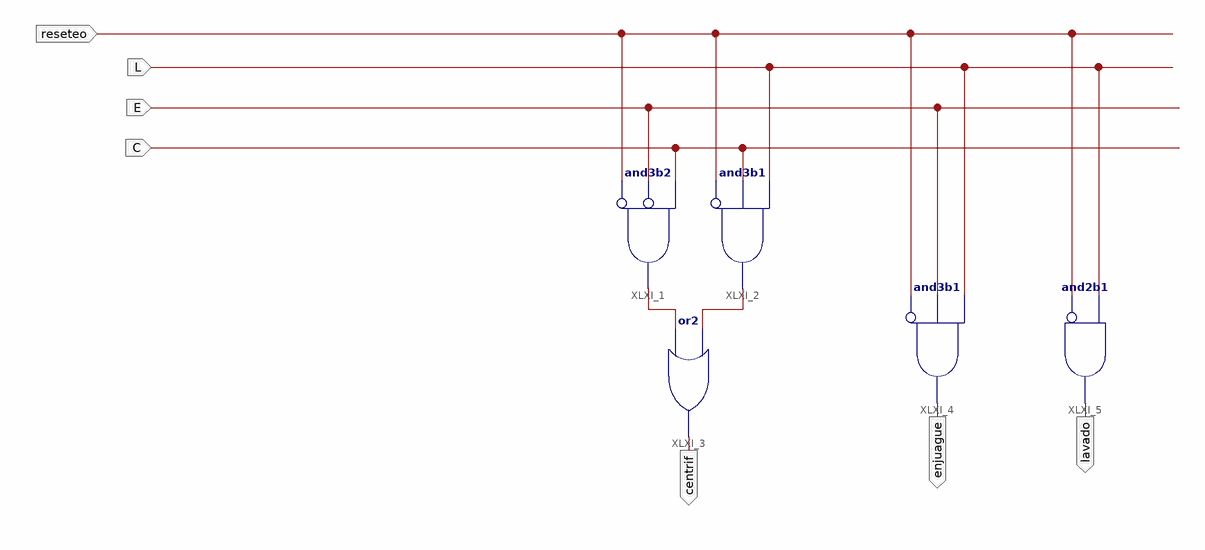
[diagram p0: schematic sheet 1]
// Xilinx ISE schematic conversorS.sch (spartan3e) as structural Verilog: 5 symbols, 7 ports
module conversorS (
  input  L,
  input  E,
  input  C,
  input  reseteo,
  output enjuague,
  output lavado,
  output centrif
);

  wire XLXN_4, XLXN_5;

  and XLXI_4 (enjuague, ~reseteo, E, L);  // and3b1
  and XLXI_5 (lavado, ~reseteo, L);  // and2b1
  and XLXI_1 (XLXN_4, ~reseteo, ~E, C);  // and3b2
  and XLXI_2 (XLXN_5, ~reseteo, C, L);  // and3b1
  or XLXI_3 (centrif, XLXN_4, XLXN_5);
endmodule
